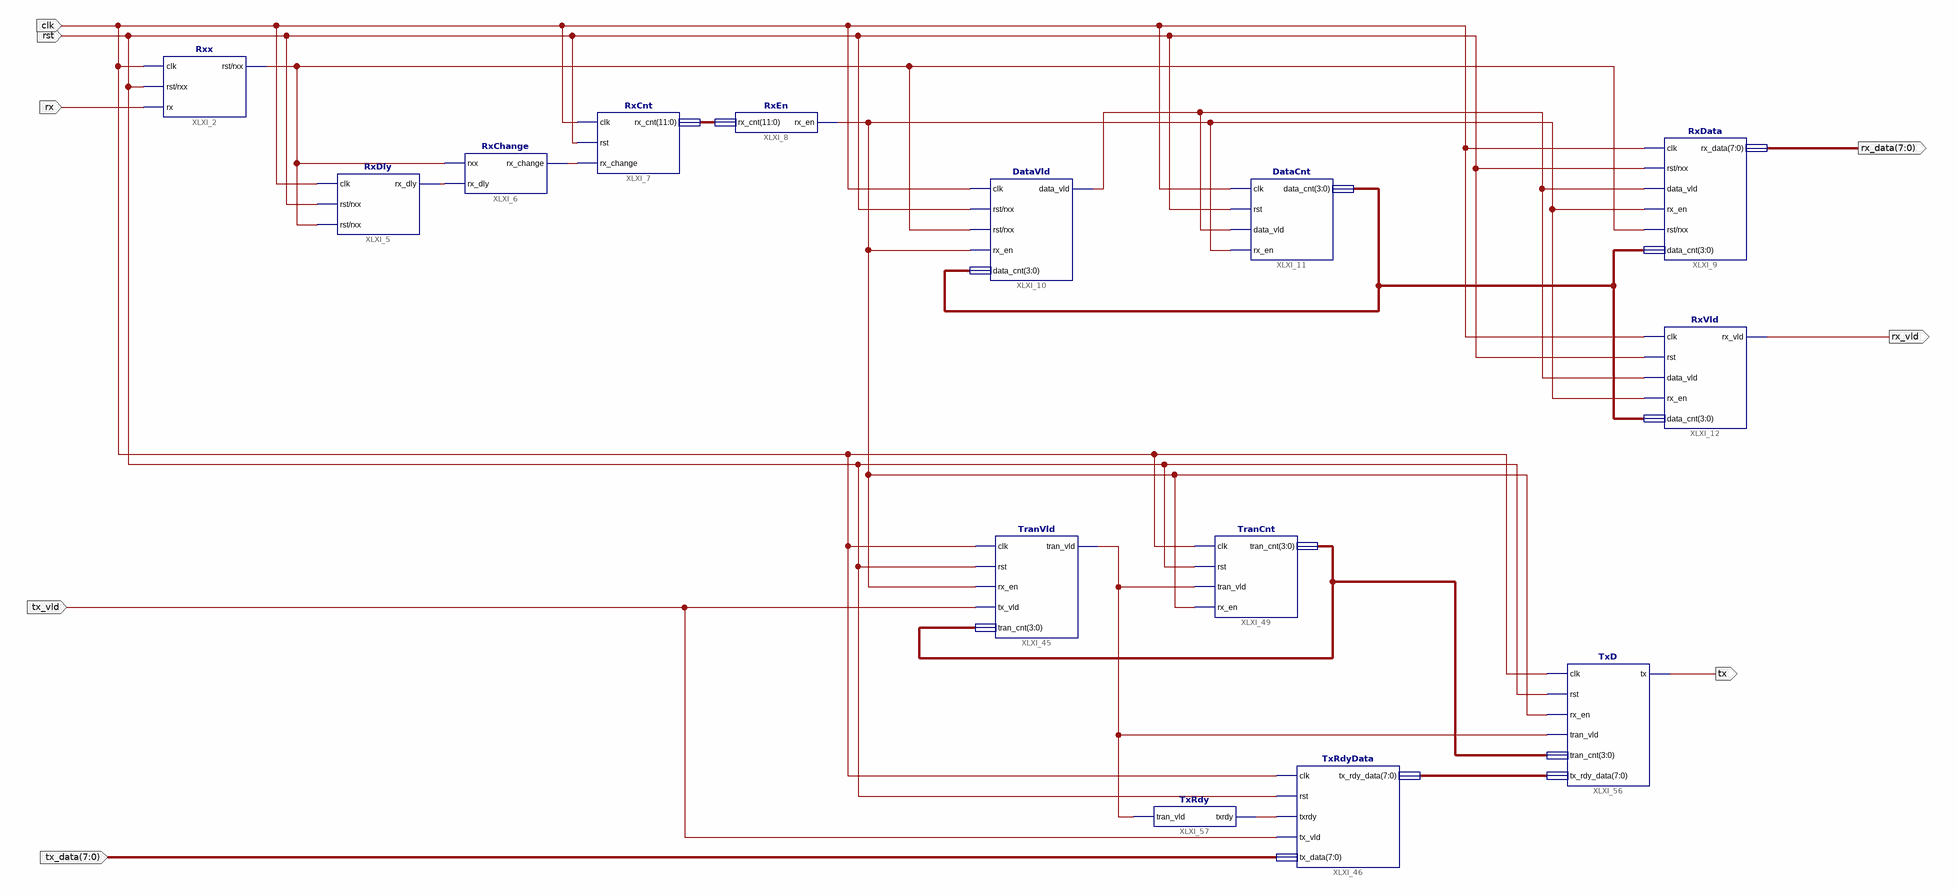
[diagram p0: schematic sheet 1]
// Xilinx ISE schematic rxtxSch.sch (spartan6) as structural Verilog: 14 symbols, 8 ports
module rxtxSch (
  input  rx,
  input  rst,
  input  [7:0] tx_data,
  input  tx_vld,
  input  clk,
  output [7:0] rx_data,
  output rx_vld,
  output tx
);

  wire XLXN_9, XLXN_10, XLXN_268, XLXN_323, XLXN_791, XLXN_798;
  wire [3:0] XLXN_471, XLXN_775;
  wire [7:0] XLXN_510;
  wire [11:0] XLXN_22;

  RxChange XLXI_6 (.rxx(rst), .rx_dly(XLXN_10), .rx_change(XLXN_9));
  RxCnt XLXI_7 (.clk(clk), .rst(rst), .rx_change(XLXN_9), .rx_cnt(XLXN_22));
  Rxx XLXI_2 (.clk(clk), .rst(rst), .rx(rx), .rxx(rst));
  RxDly XLXI_5 (.clk(clk), .rst(rst), .rxx(rst), .rx_dly(XLXN_10));
  RxEn XLXI_8 (.rx_cnt(XLXN_22), .rx_en(XLXN_798));
  DataVld XLXI_10 (.clk(clk), .rst(rst), .rxx(rst), .rx_en(XLXN_798), .data_cnt(XLXN_775), .data_vld(XLXN_268));
  DataCnt XLXI_11 (.clk(clk), .rst(rst), .data_vld(XLXN_268), .rx_en(XLXN_798), .data_cnt(XLXN_775));
  TxRdy XLXI_57 (.tran_vld(XLXN_791), .txrdy(XLXN_323));
  TranVld XLXI_45 (.clk(clk), .rst(rst), .rx_en(XLXN_798), .tx_vld(tx_vld), .tran_cnt(XLXN_471), .tran_vld(XLXN_791));
  TranCnt XLXI_49 (.clk(clk), .rst(rst), .tran_vld(XLXN_791), .rx_en(XLXN_798), .tran_cnt(XLXN_471));
  TxRdyData XLXI_46 (
    .clk(clk), .rst(rst), .txrdy(XLXN_323), .tx_vld(tx_vld), .tx_data(tx_data), .tx_rdy_data(XLXN_510));
  RxData XLXI_9 (
    .clk(clk), .rst(rst), .data_vld(XLXN_268), .rx_en(XLXN_798), .rxx(rst), .data_cnt(XLXN_775),
    .rx_data(rx_data));
  RxVld XLXI_12 (.clk(clk), .rst(rst), .data_vld(XLXN_268), .rx_en(XLXN_798), .data_cnt(XLXN_775), .rx_vld(rx_vld));
  TxD XLXI_56 (
    .clk(clk), .rst(rst), .rx_en(XLXN_798), .tran_vld(XLXN_791), .tran_cnt(XLXN_471), .tx_rdy_data(XLXN_510),
    .tx(tx));
endmodule
